# Altium schematic sheet OptoIso.SchDoc
size A4; SheetNumber: 1; SheetTotal: 1
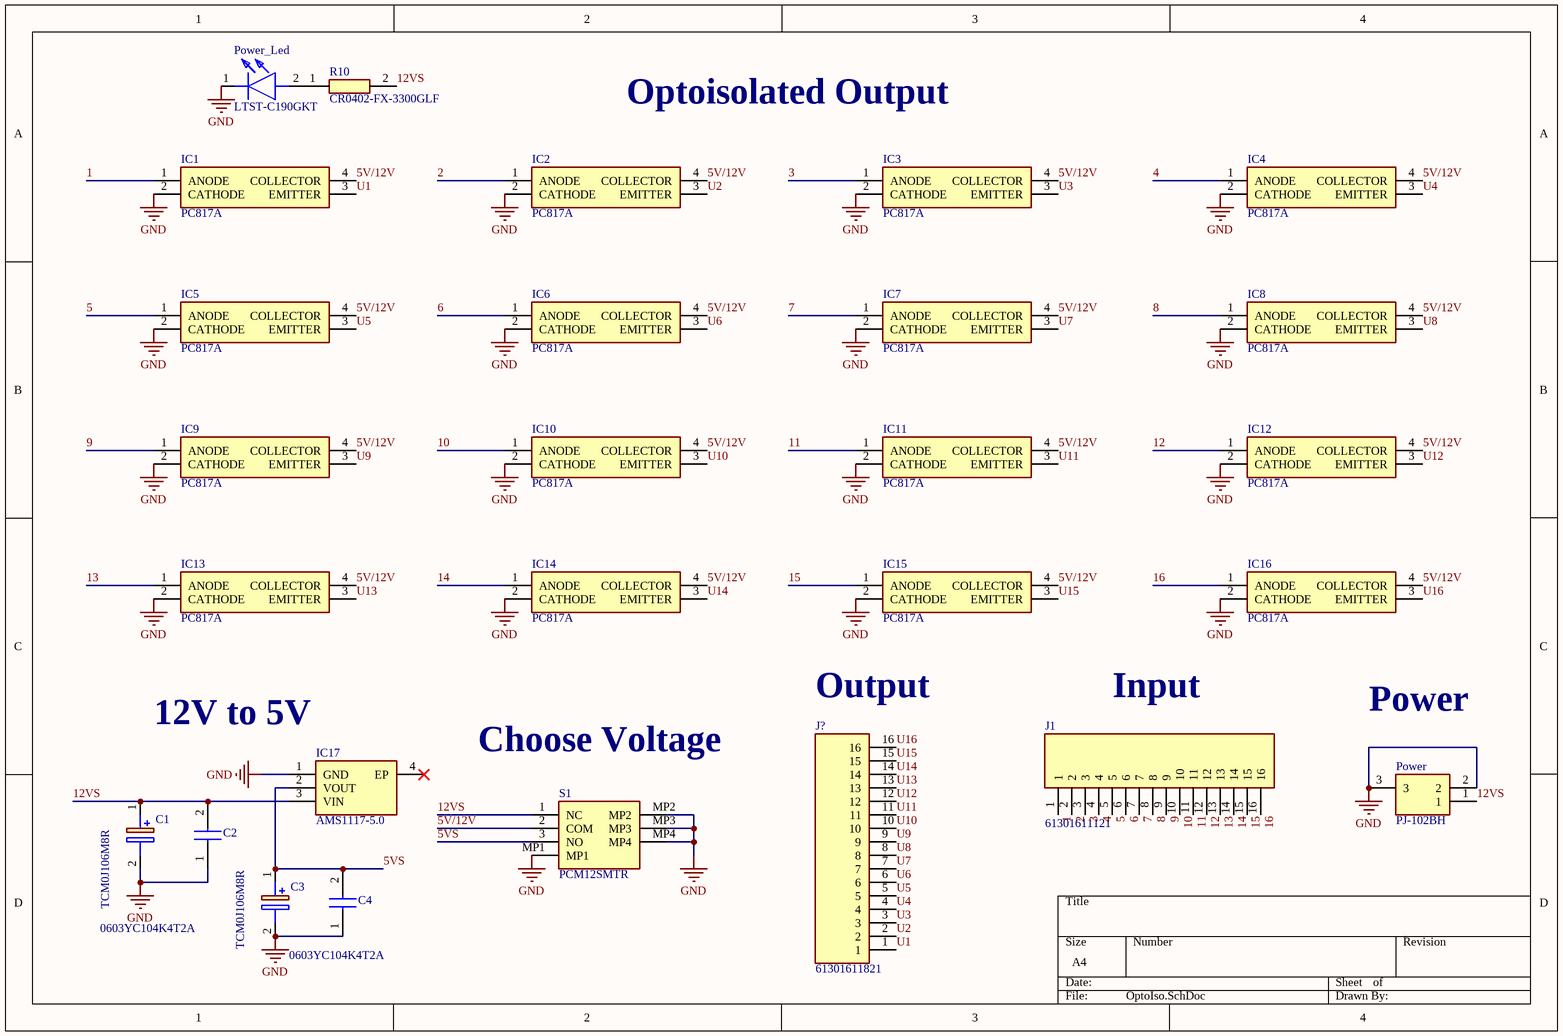
[diagram p0: OptoIso.SchDoc]

## Parts
C1  TCM0J106M8R  [CAPPM168X90N]
C2  0603YC104K4T2A  [CAPC1608X90N]
C3  TCM0J106M8R  [CAPPM168X90N]
C4  0603YC104K4T2A  [CAPC1608X90N]
IC1  PC817A  [DIP762W60P254L458H450Q4N]
IC2  PC817A  [DIP762W60P254L458H450Q4N]
IC3  PC817A  [DIP762W60P254L458H450Q4N]
IC4  PC817A  [DIP762W60P254L458H450Q4N]
IC5  PC817A  [DIP762W60P254L458H450Q4N]
IC6  PC817A  [DIP762W60P254L458H450Q4N]
IC7  PC817A  [DIP762W60P254L458H450Q4N]
IC8  PC817A  [DIP762W60P254L458H450Q4N]
IC9  PC817A  [DIP762W60P254L458H450Q4N]
IC10  PC817A  [DIP762W60P254L458H450Q4N]
IC11  PC817A  [DIP762W60P254L458H450Q4N]
IC12  PC817A  [DIP762W60P254L458H450Q4N]
IC13  PC817A  [DIP762W60P254L458H450Q4N]
IC14  PC817A  [DIP762W60P254L458H450Q4N]
IC15  PC817A  [DIP762W60P254L458H450Q4N]
IC16  PC817A  [DIP762W60P254L458H450Q4N]
IC17  AMS1117-5.0  [SOT290P700X180-4N]
J1  61301611121  [HDRV16W79P0X254_1X16_4064X254X874P]
J?  61301611821  [RHDR16W82P0X254_1X16_4114X250X865P]
Power  PJ-102BH  [PJ-102AH]
Power_Led  LTST-C190GKT  [LEDC1608X90N]
R10  CR0402-FX-3300GLF  [RESC1005X40N]
S1  PCM12SMTR  [PCM12SMTR]

## Nets
GND: C1.2(-) C2.1 C3.2(-) C4.1 IC1.2(CATHODE) IC2.2(CATHODE) IC3.2(CATHODE) IC4.2(CATHODE) IC5.2(CATHODE) IC6.2(CATHODE) IC7.2(CATHODE) IC8.2(CATHODE) IC9.2(CATHODE) IC10.2(CATHODE) IC11.2(CATHODE) IC12.2(CATHODE) IC13.2(CATHODE) IC14.2(CATHODE) IC15.2(CATHODE) IC16.2(CATHODE) IC17.1(GND) Power.2 Power.3 Power_Led.1(K) S1.MP1 S1.MP2 S1.MP3 S1.MP4
1: IC1.1(ANODE) J1.1
2: IC2.1(ANODE) J1.2
3: IC3.1(ANODE) J1.3
4: IC4.1(ANODE) J1.4
5: IC5.1(ANODE) J1.5
5V/12V: IC1.4(COLLECTOR) IC2.4(COLLECTOR) IC3.4(COLLECTOR) IC4.4(COLLECTOR) IC5.4(COLLECTOR) IC6.4(COLLECTOR) IC7.4(COLLECTOR) IC8.4(COLLECTOR) IC9.4(COLLECTOR) IC10.4(COLLECTOR) IC11.4(COLLECTOR) IC12.4(COLLECTOR) IC13.4(COLLECTOR) IC14.4(COLLECTOR) IC15.4(COLLECTOR) IC16.4(COLLECTOR) S1.2(COM)
5VS: C3.1(+) C4.2 IC17.2(VOUT) S1.3(NO)
6: IC6.1(ANODE) J1.6
7: IC7.1(ANODE) J1.7
8: IC8.1(ANODE) J1.8
9: IC9.1(ANODE) J1.9
10: IC10.1(ANODE) J1.10
11: IC11.1(ANODE) J1.11
12: IC12.1(ANODE) J1.12
12VS: C1.1(+) C2.2 IC17.3(VIN) Power.1 R10.2 S1.1(NC)
13: IC13.1(ANODE) J1.13
14: IC14.1(ANODE) J1.14
15: IC15.1(ANODE) J1.15
16: IC16.1(ANODE) J1.16
U1: IC1.3(EMITTER) J?.1
U2: IC2.3(EMITTER) J?.2
U3: IC3.3(EMITTER) J?.3
U4: IC4.3(EMITTER) J?.4
U5: IC5.3(EMITTER) J?.5
U6: IC6.3(EMITTER) J?.6
U7: IC7.3(EMITTER) J?.7
U8: IC8.3(EMITTER) J?.8
U9: IC9.3(EMITTER) J?.9
U10: IC10.3(EMITTER) J?.10
U11: IC11.3(EMITTER) J?.11
U12: IC12.3(EMITTER) J?.12
U13: IC13.3(EMITTER) J?.13
U14: IC14.3(EMITTER) J?.14
U15: IC15.3(EMITTER) J?.15
U16: IC16.3(EMITTER) J?.16
NetPower_Led_2: Power_Led.2(A) R10.1

Not connected (* = marked no-connect by the designer): IC17 4(EP)*

## Notes on the sheet
- Optoisolated Output
- (near J?) Output
- Input
- Power
- (near IC17) 12V to 5V
- Choose Voltage

## Library data of the parts
C1 C3 = TCM0J106M8R: Capacitor Polarised; Manufacturer_Name: ROHM Semiconductor; Datasheet Link: https://datasheet.datasheetarchive.com/originals/distributors/Datasheets_SAMA/255248ae09371697a9bedad935b0557d.pdf; Height: 0.9mm; Manufacturer_Part_Number: TCM0J106M8R; Mouser Part Number: 755-TCM0J106M8R; Mouser Price/Stock: https://www.mouser.com/Search/Refine.aspx?Keyword=755-TCM0J106M8R; Arrow Part Number: TCM0J106M8R; Arrow Price/Stock: https://www.arrow.com/en/products/tcm0j106m8r/rohm-semiconductor
C2 C4 = 0603YC104K4T2A: Capacitor; Manufacturer_Name: AVX; Datasheet Link: https://componentsearchengine.com/Datasheets/1/06031A100FAT2A.pdf; Height: 0.9mm; Manufacturer_Part_Number: 0603YC104K4T2A; Mouser Part Number: 581-0603YC104K4; Mouser Price/Stock: https://www.mouser.co.uk/ProductDetail/AVX/0603YC104K4T2A/?qs=Cej1j9ztgjHj4I01NaBI3A%3D%3D; Arrow Part Number: 0603YC104K4T2A; Arrow Price/Stock: https://www.arrow.com/en/products/0603yc104k4t2a/avx
IC1-IC16 = PC817A: Integrated Circuit; Manufacturer_Name: Sharp Microelectronics; Datasheet Link: https://pdf1.alldatasheet.com/datasheet-pdf/view/43370/SHARP/PC817A.html; Height: 4.5mm; Manufacturer_Part_Number: PC817A
IC17 = AMS1117-5.0: Integrated Circuit; Manufacturer_Name: Shikues; Datasheet Link: https://datasheet.lcsc.com/szlcsc/SK-AMS1117-5-0_C165483.pdf; Height: 1.8mm; Manufacturer_Part_Number: AMS1117-5.0
J1 = 61301611121: Connector; Manufacturer_Name: Wurth Elektronik; Datasheet Link: https://www.we-online.com/catalog/datasheet/61301611121.pdf; Height: 8.74mm; Manufacturer_Part_Number: 61301611121; Mouser Part Number: 710-61301611121; Mouser Price/Stock: https://www.mouser.co.uk/ProductDetail/Wurth-Elektronik/61301611121?qs=PhR8RmCirEYq%2F9PEO1%2F%252B%252Bg%3D%3D
J? = 61301611821: Connector; Manufacturer_Name: Wurth Elektronik; Datasheet Link: https://www.we-online.com/catalog/datasheet/61301611821.pdf; Height: 8.65mm; Manufacturer_Part_Number: 61301611821; Mouser Part Number: 710-61301611821; Mouser Price/Stock: https://www.mouser.co.uk/ProductDetail/Wurth-Elektronik/61301611821?qs=xZ%2FP%252Ba9zWqYIxo6RU%252B1Wuw%3D%3D
Power = PJ-102BH: Connector; Manufacturer_Name: CUI Devices; Datasheet Link: https://componentsearchengine.com/Datasheets/1/PJ-102BH.pdf; Manufacturer_Part_Number: PJ-102BH; Mouser Part Number: 490-PJ-102BH; Mouser Price/Stock: https://www.mouser.co.uk/ProductDetail/CUI-Devices/PJ-102BH?qs=WyjlAZoYn51LQvDYqCqBtA%3D%3D; Arrow Part Number: PJ-102BH; Arrow Price/Stock: https://www.arrow.com/en/products/pj-102bh/cui-devices?region=nac
Power_Led = LTST-C190GKT: LED; Manufacturer_Name: Lite-On; Datasheet Link: https://media.digikey.com/pdf/Data%20Sheets/Lite-On%20PDFs/LTST-C190GKT.pdf; Height: 0.9mm; Manufacturer_Part_Number: LTST-C190GKT; Mouser Part Number: 859-LTST-C190GKT; Mouser Price/Stock: https://www.mouser.co.uk/ProductDetail/Lite-On/LTST-C190GKT?qs=drxkyCeiWgbQzclgbojDOg%3D%3D; Arrow Part Number: LTST-C190GKT; Arrow Price/Stock: https://www.arrow.com/en/products/ltst-c190gkt/lite-on-technology?region=nac
R10 = CR0402-FX-3300GLF: Resistor; Manufacturer_Name: Bourns; Datasheet Link: https://www.bourns.com/pdfs/CR0402.pdf; Height: 0.4mm; Manufacturer_Part_Number: CR0402-FX-3300GLF; Mouser Part Number: 652-CR0402FX-3300GLF; Mouser Price/Stock: https://www.mouser.co.uk/ProductDetail/Bourns/CR0402-FX-3300GLF?qs=SFHnMgm9IsyaL104gdTOhg%3D%3D; Arrow Part Number: CR0402-FX-3300GLF; Arrow Price/Stock: https://www.arrow.com/en/products/cr0402-fx-3300glf/bourns
S1 = PCM12SMTR: Switch; Manufacturer_Name: C & K COMPONENTS; Datasheet Link: https://www.ckswitches.com/media/1424/pcm.pdf; Height: 1.4mm; Manufacturer_Part_Number: PCM12SMTR; Mouser Part Number: 611-PCM12SMTR; Mouser Price/Stock: https://www.mouser.co.uk/ProductDetail/CK/PCM12SMTR?qs=mfFuHy8STfL3qrPSfCHA7w%3D%3D; Arrow Part Number: PCM12SMTR; Arrow Price/Stock: https://www.arrow.com/en/products/pcm12smtr/ck?region=nac